# Altium schematic sheet TestMod_SEAx.SchDoc
size A3
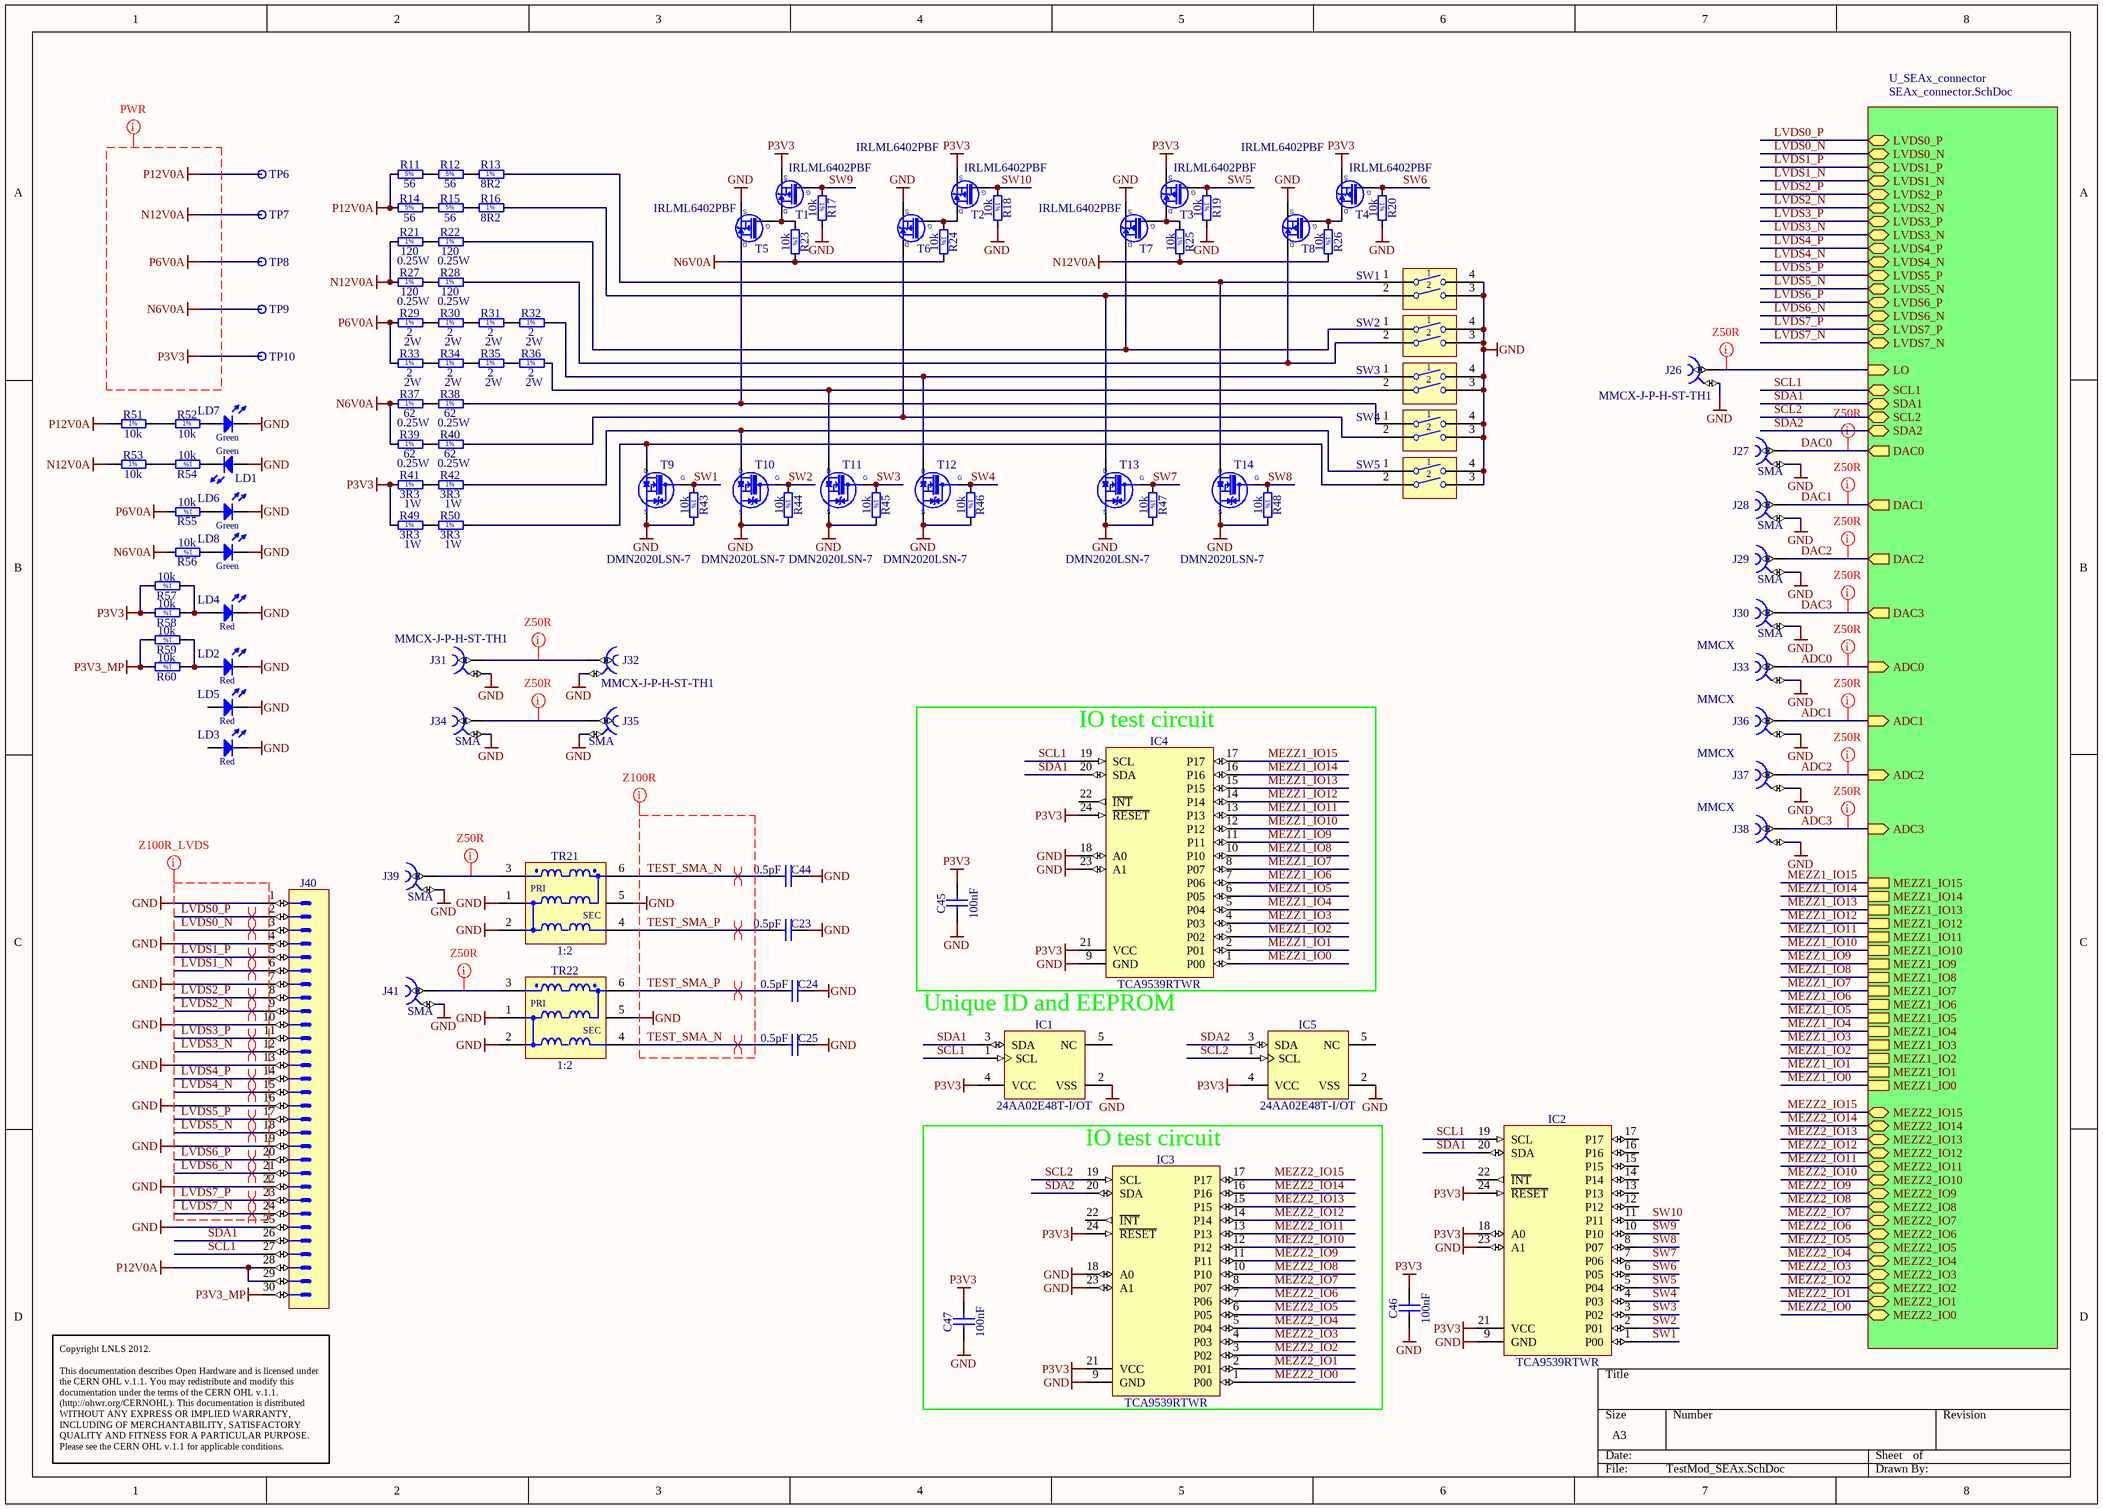
[diagram p0: TestMod_SEAx.SchDoc]

## Parts
C23  0.5pF  [CAPC1005X50N]
C24  0.5pF  [CAPC1005X50N]
C25  0.5pF  [CAPC1005X50N]
C44  0.5pF  [CAPC1005X50N]
C45  100nF  [CAPC1005X55N]
C46  100nF  [CAPC1005X55N]
C47  100nF  [CAPC1005X55N]
IC1  24AA02E48T-I/OT  [SOT95P280X145-5N]
IC2  TCA9539RTWR  [QFN50P400X400X80-25N-S255]
IC3  TCA9539RTWR  [QFN50P400X400X80-25N-S255]
IC4  TCA9539RTWR  [QFN50P400X400X80-25N-S255]
IC5  24AA02E48T-I/OT  [SOT95P280X145-5N]
J26  Manufacturer Part Number: MMCX-J-P-H-ST-TH1  [SAMTEC_MMCX-J-P-H-ST-TH1]  (hidden comment: Coax_1Female_1Shield)
J27  SMA  [AMPHENOL_901-143_IN BOARD]
J28  SMA  [AMPHENOL_901-143_IN BOARD]
J29  SMA  [AMPHENOL_901-143_IN BOARD]
J30  SMA  [AMPHENOL_901-143_IN BOARD]
J31  Manufacturer Part Number: MMCX-J-P-H-ST-TH1  [SAMTEC_MMCX-J-P-H-ST-TH1]  (hidden comment: Coax_1Female_1Shield)
J32  Manufacturer Part Number: MMCX-J-P-H-ST-TH1  [SAMTEC_MMCX-J-P-H-ST-TH1]  (hidden comment: Coax_1Female_1Shield)
J33  Family: MMCX  [HUBER-SUHNER_85_MMCX-50-0-1/111_OE]  (hidden comment: Coax_1Female_1Shield)
J34  SMA  [TYCO_5-1814832-1]
J35  SMA  [TYCO_5-1814832-1]
J36  Family: MMCX  [HUBER-SUHNER_85_MMCX-50-0-1/111_OE]  (hidden comment: Coax_1Female_1Shield)
J37  Family: MMCX  [HUBER-SUHNER_85_MMCX-50-0-1/111_OE]  (hidden comment: Coax_1Female_1Shield)
J38  Family: MMCX  [HUBER-SUHNER_85_MMCX-50-0-1/111_OE]  (hidden comment: Coax_1Female_1Shield)
J39  SMA  [TYCO_5-1814832-1]
J40  (no value)  [3M_N2530-6002RB]
J41  SMA  [TYCO_5-1814832-1]
LD1  Green  [LED_KINGBRIGHT_L-13GD]
LD2  Red  [LED_KINGBRIGHT_L-13ID]
LD3  Red  [LED_KINGBRIGHT_L-13ID]
LD4  Red  [LED_KINGBRIGHT_L-13ID]
LD5  Red  [LED_KINGBRIGHT_L-13ID]
LD6  Green  [LED_KINGBRIGHT_L-13GD]
LD7  Green  [LED_KINGBRIGHT_L-13GD]
LD8  Green  [LED_KINGBRIGHT_L-13GD]
R11  56  [RESC6331X70N]
R12  56  [RESC6331X70N]
R13  8R2  [RESC3216X65N]
R14  56  [RESC6331X70N]
R15  56  [RESC6331X70N]
R16  8R2  [RESC3216X65N]
R17  10k  [RESC1005X40N]
R18  10k  [RESC1005X40N]
R19  10k  [RESC1005X40N]
R20  10k  [RESC1005X40N]
R21  120  Power: 0.25W  [RESC3216X65N]
R22  120  Power: 0.25W  [RESC3216X65N]
R23  10k  [RESC1005X40N]
R24  10k  [RESC1005X40N]
R25  10k  [RESC1005X40N]
R26  10k  [RESC1005X40N]
R27  120  Power: 0.25W  [RESC3216X65N]
R28  120  Power: 0.25W  [RESC3216X65N]
R29  2  Power: 2W  [RESM11670X449N]
R30  2  Power: 2W  [RESM11670X449N]
R31  2  Power: 2W  [RESM11670X449N]
R32  2  Power: 2W  [RESM11670X449N]
R33  2  Power: 2W  [RESM11670X449N]
R34  2  Power: 2W  [RESM11670X449N]
R35  2  Power: 2W  [RESM11670X449N]
R36  2  Power: 2W  [RESM11670X449N]
R37  62  Power: 0.25W  [RESC3216X65N]
R38  62  Power: 0.25W  [RESC3216X65N]
R39  62  Power: 0.25W  [RESC3216X65N]
R40  62  Power: 0.25W  [RESC3216X65N]
R41  3R3  Power: 1W  [RESC6331X70N]
R42  3R3  Power: 1W  [RESC6331X70N]
R43  10k  [RESC1005X40N]
R44  10k  [RESC1005X40N]
R45  10k  [RESC1005X40N]
R46  10k  [RESC1005X40N]
R47  10k  [RESC1005X40N]
R48  10k  [RESC1005X40N]
R49  3R3  Power: 1W  [RESC6331X70N]
R50  3R3  Power: 1W  [RESC6331X70N]
R51  10k  [RESC1005X40N]
R52  10k  [RESC1005X40N]
R53  10k  [RESC1005X40N]
R54  10k  [RESC1005X40N]
R55  10k  [RESC1005X40N]
R56  10k  [RESC1005X40N]
R57  10k  [RESC1005X40N]
R58  10k  [RESC1005X40N]
R59  10k  [RESC1005X40N]
R60  10k  [RESC1005X40N]
SW1  Switch  [SW_OMRON_A6S-2102-H]  (value not drawn)
SW2  Switch  [SW_OMRON_A6S-2102-H]  (value not drawn)
SW3  Switch  [SW_OMRON_A6S-2102-H]  (value not drawn)
SW4  Switch  [SW_OMRON_A6S-2102-H]  (value not drawn)
SW5  Switch  [SW_OMRON_A6S-2102-H]  (value not drawn)
T1  IRLML6402PBF  [SOT95P237X112-3N]
T2  IRLML6402PBF  [SOT95P237X112-3N]
T3  IRLML6402PBF  [SOT95P237X112-3N]
T4  IRLML6402PBF  [SOT95P237X112-3N]
T5  IRLML6402PBF  [SOT95P237X112-3N]
T6  IRLML6402PBF  [SOT95P237X112-3N]
T7  IRLML6402PBF  [SOT95P237X112-3N]
T8  IRLML6402PBF  [SOT95P237X112-3N]
T9  DMN2020LSN-7  [SOT95P285X140-3N]
T10  DMN2020LSN-7  [SOT95P285X140-3N]
T11  DMN2020LSN-7  [SOT95P285X140-3N]
T12  DMN2020LSN-7  [SOT95P285X140-3N]
T13  DMN2020LSN-7  [SOT95P285X140-3N]
T14  DMN2020LSN-7  [SOT95P285X140-3N]
TP6  Test Point  [TPS127]  (value not drawn)
TP7  Test Point  [TPS127]  (value not drawn)
TP8  Test Point  [TPS127]  (value not drawn)
TP9  Test Point  [TPS127]  (value not drawn)
TP10  Test Point  [TPS127]  (value not drawn)
TR21  1:2  [XFMR_MINI-CIRCUITS_DB1627]
TR22  1:2  [XFMR_MINI-CIRCUITS_DB1627]

## Blocks framed on the sheet
IO test circuit: C45 IC4
IO test circuit: C47 IC3

## Sub-sheets
U_SEAx_connector = SEAx_connector.SchDoc: ADC0 (in), ADC3 (in), ADC2 (in), ADC1 (in), MEZZ2_IO15 (bidir), MEZZ2_IO14 (bidir), MEZZ2_IO13 (bidir), MEZZ2_IO12 (bidir), MEZZ2_IO11 (bidir), MEZZ2_IO10 (bidir), MEZZ2_IO9 (bidir), MEZZ2_IO8 (bidir), MEZZ2_IO7 (bidir), MEZZ2_IO6 (bidir), MEZZ2_IO5 (bidir), MEZZ2_IO4 (bidir), MEZZ2_IO3 (bidir), MEZZ2_IO2 (bidir), MEZZ2_IO1 (bidir), MEZZ2_IO0 (bidir), MEZZ1_IO15, MEZZ1_IO14, MEZZ1_IO13, MEZZ1_IO12, MEZZ1_IO11, MEZZ1_IO10, MEZZ1_IO9, MEZZ1_IO8, MEZZ1_IO7, MEZZ1_IO6, MEZZ1_IO5, MEZZ1_IO4, MEZZ1_IO3, MEZZ1_IO2, MEZZ1_IO1, MEZZ1_IO0, SCL1 (bidir), SDA1 (bidir), SCL2 (bidir), SDA2 (bidir), LVDS0_P (bidir), LVDS0_N (bidir), LVDS1_P (bidir), LVDS1_N (bidir), LVDS2_P (bidir), LVDS2_N (bidir), LVDS3_P (bidir), LVDS3_N (bidir), LVDS4_P (bidir), LVDS4_N (bidir), LVDS5_P (bidir), LVDS5_N (bidir), LVDS6_P (bidir), LVDS6_N (bidir), LVDS7_P (bidir), LVDS7_N (bidir), LO (in), DAC0 (out), DAC3 (out), DAC2 (out), DAC1 (out)

## Nets
GND: C23.2 C24.2 C25.2 C44.2 C45.1 C46.1 C47.1 IC1.2(VSS) IC2.9(GND) IC2.23(A1) IC3.9(GND) IC3.18(A0) IC3.23(A1) IC4.9(GND) IC4.18(A0) IC4.23(A1) IC5.2(VSS) J26.2 J27.2 J28.2 J29.2 J30.2 J31.2 J32.2 J33.2 J34.2 J35.2 J36.2 J37.2 J38.2 J39.2 J40.1 J40.4 J40.7 J40.10 J40.13 J40.16 J40.19 J40.22 J40.25 J41.2 LD1.2(A) LD2.1(C) LD3.1(C) LD4.1(C) LD5.1(C) LD6.1(C) LD7.1(C) LD8.1(C) R17.2 R18.2 R19.2 R20.2 R43.2 R44.2 R45.2 R46.2 R47.2 R48.2 SW1.3 SW1.4 SW2.3 SW2.4 SW3.3 SW3.4 SW4.3 SW4.4 SW5.3 SW5.4 T5.2(S) T6.2(S) T7.2(S) T8.2(S) T9.2(S) T10.2(S) T11.2(S) T12.2(S) T13.2(S) T14.2(S) TR21.1(P1) TR21.2(P1) TR21.5(NC) TR22.1(P1) TR22.2(P1) TR22.5(NC)
N6V0A: R23.2 R24.2 R37.1 R39.1 R56.2 TP9.1
N12V0A: R21.1 R25.2 R26.2 R27.1 R53.1 TP7.1
P3V3: C45.2 C46.2 C47.2 IC1.4(VCC) IC2.18(A0) IC2.21(VCC) IC2.24(~{RESET}) IC3.21(VCC) IC3.24(~{RESET}) IC4.21(VCC) IC4.24(~{RESET}) IC5.4(VCC) R41.1 R49.1 R57.2 R58.2 T1.2(S) T2.2(S) T3.2(S) T4.2(S) TP10.1
P3V3_MP: J40.30 R59.2 R60.2
P6V0A: R29.1 R33.1 R55.2 TP8.1
P12V0A: J40.28 J40.29 R11.1 R14.1 R51.1 TP6.1
ADC0: J33.1 ; sheet U_SEAx_connector/ADC0
ADC1: J36.1 ; sheet U_SEAx_connector/ADC1
ADC2: J37.1 ; sheet U_SEAx_connector/ADC2
ADC3: J38.1 ; sheet U_SEAx_connector/ADC3
DAC0: J27.1 ; sheet U_SEAx_connector/DAC0
DAC1: J28.1 ; sheet U_SEAx_connector/DAC1
DAC2: J29.1 ; sheet U_SEAx_connector/DAC2
DAC3: J30.1 ; sheet U_SEAx_connector/DAC3
LVDS0_N: J40.3 ; sheet U_SEAx_connector/LVDS0_N
LVDS0_P: J40.2 ; sheet U_SEAx_connector/LVDS0_P
LVDS1_N: J40.6 ; sheet U_SEAx_connector/LVDS1_N
LVDS1_P: J40.5 ; sheet U_SEAx_connector/LVDS1_P
LVDS2_N: J40.9 ; sheet U_SEAx_connector/LVDS2_N
LVDS2_P: J40.8 ; sheet U_SEAx_connector/LVDS2_P
LVDS3_N: J40.12 ; sheet U_SEAx_connector/LVDS3_N
LVDS3_P: J40.11 ; sheet U_SEAx_connector/LVDS3_P
LVDS4_N: J40.15 ; sheet U_SEAx_connector/LVDS4_N
LVDS4_P: J40.14 ; sheet U_SEAx_connector/LVDS4_P
LVDS5_N: J40.18 ; sheet U_SEAx_connector/LVDS5_N
LVDS5_P: J40.17 ; sheet U_SEAx_connector/LVDS5_P
LVDS6_N: J40.21 ; sheet U_SEAx_connector/LVDS6_N
LVDS6_P: J40.20 ; sheet U_SEAx_connector/LVDS6_P
LVDS7_N: J40.24 ; sheet U_SEAx_connector/LVDS7_N
LVDS7_P: J40.23 ; sheet U_SEAx_connector/LVDS7_P
MEZZ1_IO0: IC4.1(P00) ; sheet U_SEAx_connector/MEZZ1_IO0
MEZZ1_IO1: IC4.2(P01) ; sheet U_SEAx_connector/MEZZ1_IO1
MEZZ1_IO2: IC4.3(P02) ; sheet U_SEAx_connector/MEZZ1_IO2
MEZZ1_IO3: IC4.4(P03) ; sheet U_SEAx_connector/MEZZ1_IO3
MEZZ1_IO4: IC4.5(P04) ; sheet U_SEAx_connector/MEZZ1_IO4
MEZZ1_IO5: IC4.6(P05) ; sheet U_SEAx_connector/MEZZ1_IO5
MEZZ1_IO6: IC4.7(P06) ; sheet U_SEAx_connector/MEZZ1_IO6
MEZZ1_IO7: IC4.8(P07) ; sheet U_SEAx_connector/MEZZ1_IO7
MEZZ1_IO8: IC4.10(P10) ; sheet U_SEAx_connector/MEZZ1_IO8
MEZZ1_IO9: IC4.11(P11) ; sheet U_SEAx_connector/MEZZ1_IO9
MEZZ1_IO10: IC4.12(P12) ; sheet U_SEAx_connector/MEZZ1_IO10
MEZZ1_IO11: IC4.13(P13) ; sheet U_SEAx_connector/MEZZ1_IO11
MEZZ1_IO12: IC4.14(P14) ; sheet U_SEAx_connector/MEZZ1_IO12
MEZZ1_IO13: IC4.15(P15) ; sheet U_SEAx_connector/MEZZ1_IO13
MEZZ1_IO14: IC4.16(P16) ; sheet U_SEAx_connector/MEZZ1_IO14
MEZZ1_IO15: IC4.17(P17) ; sheet U_SEAx_connector/MEZZ1_IO15
MEZZ2_IO0: IC3.1(P00) ; sheet U_SEAx_connector/MEZZ2_IO0
MEZZ2_IO1: IC3.2(P01) ; sheet U_SEAx_connector/MEZZ2_IO1
MEZZ2_IO2: IC3.3(P02) ; sheet U_SEAx_connector/MEZZ2_IO2
MEZZ2_IO3: IC3.4(P03) ; sheet U_SEAx_connector/MEZZ2_IO3
MEZZ2_IO4: IC3.5(P04) ; sheet U_SEAx_connector/MEZZ2_IO4
MEZZ2_IO5: IC3.6(P05) ; sheet U_SEAx_connector/MEZZ2_IO5
MEZZ2_IO6: IC3.7(P06) ; sheet U_SEAx_connector/MEZZ2_IO6
MEZZ2_IO7: IC3.8(P07) ; sheet U_SEAx_connector/MEZZ2_IO7
MEZZ2_IO8: IC3.10(P10) ; sheet U_SEAx_connector/MEZZ2_IO8
MEZZ2_IO9: IC3.11(P11) ; sheet U_SEAx_connector/MEZZ2_IO9
MEZZ2_IO10: IC3.12(P12) ; sheet U_SEAx_connector/MEZZ2_IO10
MEZZ2_IO11: IC3.13(P13) ; sheet U_SEAx_connector/MEZZ2_IO11
MEZZ2_IO12: IC3.14(P14) ; sheet U_SEAx_connector/MEZZ2_IO12
MEZZ2_IO13: IC3.15(P15) ; sheet U_SEAx_connector/MEZZ2_IO13
MEZZ2_IO14: IC3.16(P16) ; sheet U_SEAx_connector/MEZZ2_IO14
MEZZ2_IO15: IC3.17(P17) ; sheet U_SEAx_connector/MEZZ2_IO15
SCL1: IC1.1(SCL) IC2.19(SCL) IC4.19(SCL) J40.27 ; sheet U_SEAx_connector/SCL1
SCL2: IC3.19(SCL) IC5.1(SCL) ; sheet U_SEAx_connector/SCL2
SDA1: IC1.3(SDA) IC2.20(SDA) IC4.20(SDA) J40.26 ; sheet U_SEAx_connector/SDA1
SDA2: IC3.20(SDA) IC5.3(SDA) ; sheet U_SEAx_connector/SDA2
SW1: IC2.1(P00) R43.1 T9.1(G)
SW2: IC2.2(P01) R44.1 T10.1(G)
SW3: IC2.3(P02) R45.1 T11.1(G)
SW4: IC2.4(P03) R46.1 T12.1(G)
SW5: IC2.5(P04) R19.1 T3.1(G)
SW6: IC2.6(P05) R20.1 T4.1(G)
SW7: IC2.7(P06) R47.1 T13.1(G)
SW8: IC2.8(P07) R48.1 T14.1(G)
SW9: IC2.10(P10) R17.1 T1.1(G)
SW10: IC2.11(P11) R18.1 T2.1(G)
TEST_SMA_N: C25.1 C44.1 TR21.6(S1) TR22.4(S1)
TEST_SMA_P: C23.1 C24.1 TR21.4(S1) TR22.6(S1)
NetJ26_1: J26.1 ; sheet U_SEAx_connector/LO
NetJ31_1: J31.1 J32.1
NetJ34_1: J34.1 J35.1
NetJ39_1: J39.1 TR21.3(P1)
NetJ41_1: J41.1 TR22.3(P1)
NetLD1_1: LD1.1(C) R54.1
NetLD2_2: LD2.2(A) R59.1 R60.1
NetLD4_2: LD4.2(A) R57.1 R58.1
NetLD6_2: LD6.2(A) R55.1
NetLD7_2: LD7.2(A) R52.2
NetLD8_2: LD8.2(A) R56.1
NetR11_2: R11.2 R12.1
NetR12_2: R12.2 R13.1
NetR13_2: R13.2 SW1.1 T14.3(D)
NetR14_2: R14.2 R15.1
NetR15_2: R15.2 R16.1
NetR16_2: R16.2 SW1.2 T13.3(D)
NetR21_2: R21.2 R22.1
NetR22_2: R22.2 SW2.1 T7.3(D)
NetR23_1: R23.1 T1.3(D) T5.1(G)
NetR24_1: R24.1 T2.3(D) T6.1(G)
NetR25_1: R25.1 T3.3(D) T7.1(G)
NetR26_1: R26.1 T4.3(D) T8.1(G)
NetR27_2: R27.2 R28.1
NetR28_2: R28.2 SW2.2 T8.3(D)
NetR29_2: R29.2 R30.1
NetR30_2: R30.2 R31.1
NetR31_2: R31.2 R32.1
NetR32_2: R32.2 SW3.1 T12.3(D)
NetR33_2: R33.2 R34.1
NetR34_2: R34.2 R35.1
NetR35_2: R35.2 R36.1
NetR36_2: R36.2 SW3.2 T11.3(D)
NetR37_2: R37.2 R38.1
NetR38_2: R38.2 SW4.1 T5.3(D)
NetR39_2: R39.2 R40.1
NetR40_2: R40.2 SW4.2 T6.3(D)
NetR41_2: R41.2 R42.1
NetR42_2: R42.2 SW5.1 T10.3(D)
NetR49_2: R49.2 R50.1
NetR50_2: R50.2 SW5.2 T9.3(D)
NetR51_2: R51.2 R52.1
NetR53_2: R53.2 R54.2

Not connected (* = marked no-connect by the designer): IC1 5(NC); IC2 12(P12) 13(P13) 14(P14) 15(P15) 16(P16) 17(P17) 22(~{INT}); IC3 22(~{INT}); IC4 22(~{INT}); IC5 5(NC); LD3 2(A); LD5 2(A)

## Layout directives
differential pair: LVDS0_N, LVDS0_P, LVDS1_N, LVDS1_P, LVDS2_N, LVDS2_P, LVDS3_N, LVDS3_P, LVDS4_N, LVDS4_P, LVDS5_N, LVDS5_P, LVDS6_N, LVDS6_P, LVDS7_N, LVDS7_P, TEST_SMA_N, TEST_SMA_P
rule Impedance Constraint [Min = 49.00    Max = 51.00    ]; net class Z50R: ADC0, ADC1, ADC2, ADC3, DAC0, DAC1, DAC2, DAC3, NetJ26_1, NetJ31_1, NetJ34_1, NetJ39_1, NetJ41_1
rule Differential Pairs Routing [Pref Gap = 6mil    Min Gap  = 6mil    Max Gap  = 6milPref Width = 11mil    Min Width  = 11mil    Max Width  = 11mil]: GND, LVDS0_N, LVDS0_P, LVDS1_N, LVDS1_P, LVDS2_N, LVDS2_P, LVDS3_N, LVDS3_P, LVDS4_N, LVDS4_P, LVDS5_N, LVDS5_P, LVDS6_N, LVDS6_P, LVDS7_N, LVDS7_P
rule Width Constraint [Pref Width = 30mil    Min Width = 10mil    Max Width = 100mil]; net class HPWR: N6V0A, N12V0A, P3V3, P6V0A, P12V0A
rule Differential Pairs Routing [Pref Gap = 12mil    Min Gap  = 12mil    Max Gap  = 12milPref Width = 14mil    Min Width  = 14mil    Max Width  = 14mil]: GND, TEST_SMA_N, TEST_SMA_P

## Notes on the sheet
- Unique ID and EEPROM
- (near J40) Copyright LNLS 2012.
  This documentation describes Open Hardware and is licensed under the CERN OHL v.1.1. You may redistribute and modify this documentation under the terms of the CERN OHL v.1.1. (http://ohwr.org/CERNOHL). This documentation is distributed WITHOUT ANY EXPRESS OR IMPLIED WARRANTY, INCLUDING OF MERCHANTABILITY, SATISFACTORY QUALITY AND FITNESS FOR A PARTICULAR PURPOSE. Please see the CERN OHL v.1.1 for applicable conditions.
- (in symbol R0402_10K_1%_0.0625W_100PPM) 1%
- (in symbol R1206_8R2_1%_0.25W_200PPM) 1%
- (in symbol R1206_62R_1%_0.25W_100PPM) 1%
- (in symbol R1206_120R_1%_0.25W_100PPM) 1%
- (in symbol R2512_3R3_1%_1W_200PPM) 1%
- (in symbol R2512_56R_5%_1W_200PPM) 5%
- (in symbol R4527_2R_1%_2W_50PPM) 1%
- (in symbol XFMR_MINI-CIRCUITS_TCM2-43X+) PRI; SEC

## Library data of the parts
C23-C25 C44 = CC0402_0.5PF_25V_0.05PF_AVX_04023J0R5ABSTR: Non-polarised capacitor; Part Description: Thin-Film Chip Capacitors for RF Signal and Power Applications, Accu-P Series; Manufacturer: AVX; Voltage: 25V; Tolerance: ±0.05pF; Part Number: CC0402_0.5PF_25V_0.05PF_AVX_04023J0R5ABSTR; Component Kind: Standard; Component Type: Standard; Pin Count: 2; Value: 0.5pF; Status: None; Manufacturer Part Number: 04023J0R5ABSTR; Case: 0402; Mounted: Yes; Socket: No; SMD: Yes; Sense: No; ComponentHeight: 0.5mm; HelpURL: \\cern.ch\dfs\Applications\Altium\Datasheets\CC0402_AVX_ACCU-P.pdf; Author: CERN DEM JLC; CreateDate: 22.02.2017; LatestRevisionDate: 22.02.2017
C45-C47 = CC0402_100NF_16V_10%_X5R: Non-polarised capacitor; Part Description: SMD Multilayer Chip Ceramic Capacitor; Manufacturer: GENERIC; Manufacturer1 Part Number: GRM155R61C104KA88D; Voltage: 16V; TC: X5R; Tolerance: ±10%; Part Number: CC0402_100NF_16V_10%_X5R; Component Kind: Standard; Component Type: Standard; Pin Count: 2; Value: 100nF; Status: None; Manufacturer Part Number: CC0402_100NF_16V_10%_X5R; Case: 0402; Mounted: Yes; Socket: No; SMD: Yes; Sense: No; Manufacturer1 Example: MURATA; Manufacturer1 ComponentHeight: 0.55mm; HelpURL: \\cern.ch\dfs\Applications\Altium\Datasheets\CC0402_X5R_MURATA_GRM.pdf; Author: CERN DEM JLC; CreateDate: 10.12.2013; LatestRevisionDate: 10.12.2013
IC1 IC5 = 24AA02E48T-I/OT: 1.7V-5.5V, 2K I2C Serial EEPROM With EUI-48 Node Identity; Manufacturer: MICROCHIP TECHNOLOGY; PressFit: No; Bonding: No; Part Number: 24AA02E48T-I/OT; Component Kind: Standard; Component Type: Standard; Device: 24AA02E48T-I/OT; PackageDescription: SOT, 0.95mm pitch; 5 pin, 1.60mm W X 2.90mm L X 1.45mm H body, IPC Medium Density; Part Description: 1.7V-5.5V, 2K I2C Serial EEPROM With EUI-48 Node Identity; Manufacturer Part Number: 24AA02E48T-I/OT; Pin Count: 5; Case: SOT23-5; Mounted: Yes; Socket: No; SMD: Yes; Sense: No; ComponentHeight: 1.45mm; HelpURL: \\cern.ch\dfs\Applications\Altium\Datasheets\24AA02E48T-I-OT.pdf; Author: CERN DEM MR; CreateDate: 31.03.2016; LatestRevisionDate: 31.03.2016
IC2-IC4 = TCA9539RTWR: Low-Voltage 16-Bit I2C and SMBus I/O Expander; Part Description: Low Voltage 16-Bit I2C and SMBus Low-Power I/O Expander With Interrupt Output, Reset Pin, Configuration Registers; Manufacturer: TEXAS INSTRUMENTS; PressFit: No; Bonding: No; Part Number: TCA9539RTWR; Component Kind: Standard; Component Type: Standard; Device: TCA9539RTWR; PackageDescription: QFN, 0.50mm Pitch, Square; 24 Pin, 4.00mm X 4.00mm X 0.80mm H Body (w/Thermal Tab 2.55 X 2.55 mm), IPC Medium Density; Manufacturer Part Number: TCA9539RTWR; Pin Count: 25; Case: QFN24; Mounted: Yes; Socket: No; SMD: Yes; Sense: No; ComponentHeight: 0.8mm; Author: CERN DEM MR; HelpURL: \\cern.ch\dfs\Applications\Altium\Datasheets\TCA9539RTWR.pdf; CreateDate: 01.12.2015; LatestRevisionDate: 01.12.2015
J26 J31 J32 = SAMTEC_MMCX-J-P-H-ST-TH1: Part Description: Straight Through-hole 50 Ohm Micro Mini RF Jack, MMCX Series; Manufacturer: SAMTEC; PressFit: No; Part Number: SAMTEC_MMCX-J-P-H-ST-TH1; Component Kind: Standard; Component Type: Standard; Pin Count: 2; Mounted: Yes; Socket: No; Sense: No; SMD: No; Status: None; ComponentHeight: 4.35mm; HelpURL: \\cern.ch\dfs\Applications\Altium\Datasheets\SAMTEC_MMCX-J-P-H-ST-TH1.pdf; Author: CERN DEM JLC; CreateDate: 05.12.2012; LatestRevisionDate: 05.12.2012
J27-J30 = CON_SMA_RA_AMP: AMPHENOL_901-143; Part Description: 50 Ohm Through Hole SMA 90 degrees PCB Jack; PressFit: No; Part Number: AMPHENOL_901-143; Component Kind: Standard; Component Type: Standard; Pin Count: 5; Family: SMA; Mounted: Yes; Socket: No; SMD: No; Sense: No; Status: None; Manufacturer: AMPHENOL; Manufacturer Part Number: 901-143; ComponentHeight: 10.0mm; Author: LNLS DIG GBMB; CreateDate: 31/05/2016; LatestRevisionDate: 02/03/2017
J33 J36-J38 = HUBER-SUHNER_85_MMCX-50-0-1/111_OE: Part Description: MMCX 50 Ohms Right Angle PCB Jack; Manufacturer: HUBER+SUHNER; PressFit: No; Part Number: HUBER-SUHNER_85_MMCX-50-0-1/111_OE; Component Kind: Standard; Component Type: Standard; Pin Count: 2; Mounted: Yes; Socket: No; SMD: No; Sense: No; Status: None; Manufacturer Part Number: 85_MMCX-50-0-1/111_OE; ComponentHeight: 9.6mm; HelpURL: \\cern.ch\dfs\Applications\Altium\Datasheets\HUBER-SUHNER_85_MMCX-50-0-1-111_OE.pdf; Author: CERN DEM JLC; CreateDate: 06.11.2014; LatestRevisionDate: 06.11.2014
J34 J35 J39 J41 = TYCO_5-1814832-1: Part Description: 50 Ohms SMA Straight PCB Die Socket; Manufacturer: TYCO ELECTRONICS; PressFit: No; Part Number: TYCO_5-1814832-1; Component Kind: Standard; Component Type: Standard; Pin Count: 2; Family: SMA; Mounted: Yes; Socket: No; SMD: No; Sense: No; Status: None; Manufacturer Part Number: 5-1814832-1; ComponentHeight: 13.5mm; HelpURL: \\cern.ch\dfs\Applications\Altium\Datasheets\TYCO_5-1814832-1.pdf; Author: CERN DEM JLC; CreateDate: 17.11.2009; LatestRevisionDate: 17.11.2009
J40 = 3M_N2530-6002RB: Connector 30 Male; Part Description: 30 Contacts - Straight .100'' x .100'' Low Profile Four-Wall Header, 2500 Series; Manufacturer: 3M; PressFit: No; Part Number: 3M_N2530-6002RB; Component Kind: Standard; Component Type: Standard; Pin Count: 30; Family: Header 30; Mounted: Yes; Socket: No; SMD: No; Sense: No; Status: None; Manufacturer Part Number: N2530-6002RB; ComponentHeight: 10.03mm; HelpURL: \\cern.ch\dfs\Applications\Altium\Datasheets\3M_N2530-6002RB.pdf; Author: CERN DEM JLC; CreateDate: 11.02.2009; LatestRevisionDate: 11.08.2009
LD1 LD6-LD8 = LED_2mm_RA_Green: LED Green 2mm; Part Description: Green LED, 2mm round , RA; Manufacturer: KINGBRIGHT; Manufacturer Part Number: L-13GD; PressFit: No; Bonding: No; Part Number: LED_KINGBRIGHT_L-13GD; Component Kind: Standard; Component Type: Standard; Color: Green; PackageDescription: 2mm THT LED; Pin Count: 2; Mounted: Yes; Socket: No; SMD: No; Sense: No; ComponentHeight: 0.65mm; HelpURL: \\cern.ch\dfs\Applications\Altium\Datasheets\LED_KINGBRIGHT_KPH-1608SURCK.pdf; Author: GK; CreateDate: 03.07.2017; LatestRevisionDate: 03.07.2017
LD2-LD5 = LED_2mm_RA_Red: LED Red 2mm; Part Description: Red LED, 2mm round , RA; Manufacturer: KINGBRIGHT; Manufacturer Part Number: L-13ID; PressFit: No; Bonding: No; Part Number: LED_KINGBRIGHT_L-13ID; Component Kind: Standard; Component Type: Standard; Color: Red; PackageDescription: 2mm THT LED; Pin Count: 2; Mounted: Yes; Socket: No; SMD: No; Sense: No; ComponentHeight: 0.65mm; HelpURL: \\cern.ch\dfs\Applications\Altium\Datasheets\LED_KINGBRIGHT_KPH-1608SURCK.pdf; Author: GK; CreateDate: 03.07.2017; LatestRevisionDate: 03.07.2017
R11 R12 R14 R15 = R2512_56R_5%_1W_200PPM: Resistor - 5%; Part Description: Surface Mount Power Resistor; Manufacturer: GENERIC; Manufacturer1 Part Number: 352056RJT; Power: 1W; TC: ±200ppm/°C; Part Number: R2512_56R_5%_1W_200PPM; Component Kind: Standard; Component Type: Standard; Pin Count: 2; Value: 56; Status: None; Tolerance: ±5%; Manufacturer Part Number: R2512_56R_5%_1W_200PPM; Case: 2512; Mounted: Yes; Sense: No; Socket: No; SMD: Yes; Manufacturer1 Example: TYCO ELECTRONICS; Manufacturer1 ComponentHeight: 0.7mm; HelpURL: \\cern.ch\dfs\Applications\Altium\Datasheets\R2512_TYCO_3520.pdf; Author: CERN DEM JLC; CreateDate: 21.07.2010; LatestRevisionDate: 21.07.2010
R13 R16 = R1206_8R2_1%_0.25W_200PPM: Resistor - 1%; Part Description: General Purpose Thick Film Chip Resistor; Manufacturer: GENERIC; Manufacturer1 Part Number: 232272468208; Power: 0.25W; TC: ±200ppm/°C; Part Number: R1206_8R2_1%_0.25W_200PPM; Component Kind: Standard; Component Type: Standard; Pin Count: 2; Value: 8R2; Status: Preferred; Tolerance: ±1%; Manufacturer Part Number: R1206_8R2_1%_0.25W_200PPM; Case: 1206; Mounted: Yes; Sense: No; Socket: No; SMD: Yes; Manufacturer1 Example: PHYCOMP; Manufacturer1 ComponentHeight: 0.65mm; HelpURL: \\cern.ch\dfs\Applications\Altium\Datasheets\R1206_Phycomp_RC1206.pdf; Author: CERN DEM JLC; CreateDate: 03.12.2007; LatestRevisionDate: 24.06.2009
R17-R20 R23-R26 R43-R48 R51-R60 = R0402_10K_1%_0.0625W_100PPM: Resistor - 1%; Part Description: General Purpose Thick Film Chip Resistor; Manufacturer: GENERIC; Manufacturer1 Part Number: 232270671003L; TC: ±100ppm/°C; Part Number: R0402_10K_1%_0.0625W_100PPM; Component Kind: Standard; Component Type: Standard; Pin Count: 2; Value: 10k; Status: Not recommended; Power: 0.0625W; Tolerance: ±1%; Manufacturer Part Number: R0402_10K_1%_0.0625W_100PPM; Case: 0402; Mounted: Yes; Sense: No; Socket: No; SMD: Yes; Manufacturer1 Example: YAGEO PHYCOMP; Manufacturer1 ComponentHeight: 0.4mm; HelpURL: \\cern.ch\dfs\Applications\Altium\Datasheets\R0402_Phycomp_RC0402.pdf; Author: CERN DEM JLC; CreateDate: 03.12.2007; LatestRevisionDate: 17.10.2012
R21 R22 R27 R28 = R1206_120R_1%_0.25W_100PPM: Resistor - 1%; Part Description: General Purpose Thick Film Chip Resistor; Manufacturer: GENERIC; Manufacturer1 Part Number: NRC12F1200TRF; TC: ±100ppm/°C; Part Number: R1206_120R_1%_0.25W_100PPM; Component Kind: Standard; Component Type: Standard; Pin Count: 2; Value: 120; Status: Preferred; Tolerance: ±1%; Manufacturer Part Number: R1206_120R_1%_0.25W_100PPM; Case: 1206; Mounted: Yes; Sense: No; Socket: No; SMD: Yes; Manufacturer1 Example: NIC COMPONENT; Manufacturer1 ComponentHeight: 0.65mm; HelpURL: \\cern.ch\dfs\Applications\Altium\Datasheets\R1206_NIC_NRC.pdf; Author: CERN DEM JLC; CreateDate: 03.12.2007; LatestRevisionDate: 13.03.2008
R29-R36 = R4527_2R_1%_2W_50PPM: Resistor - 1%; Part Description: Surface Mount Precision Power Wirewound Resistor; Manufacturer: VISHAY DALE; Manufacturer Part Number: WSC45272R000FEA; TC: ±50ppm/°C; Part Number: R4527_2R_1%_2W_50PPM; Component Kind: Standard; Component Type: Standard; Pin Count: 2; Value: 2; Status: None; Tolerance: ±1%; Case: 4527; Mounted: Yes; Sense: No; Socket: No; SMD: Yes; ComponentHeight: 4.49mm; HelpURL: \\cern.ch\dfs\Applications\Altium\Datasheets\R4527_VISHAY_WSC.pdf; Author: CERN DEM JLC; CreateDate: 22.03.2011; LatestRevisionDate: 22.03.2011
R37-R40 = R1206_62R_1%_0.25W_100PPM: Resistor - 1%; Part Description: General Purpose Thick Film Chip Resistor; Manufacturer: GENERIC; Manufacturer1 Part Number: NRC12F62R0TRF; TC: ±100ppm/°C; Part Number: R1206_62R_1%_0.25W_100PPM; Component Kind: Standard; Component Type: Standard; Pin Count: 2; Value: 62; Status: Preferred; Tolerance: ±1%; Manufacturer Part Number: R1206_62R_1%_0.25W_100PPM; Case: 1206; Mounted: Yes; Sense: No; Socket: No; SMD: Yes; Manufacturer1 Example: NIC COMPONENT; Manufacturer1 ComponentHeight: 0.65mm; HelpURL: \\cern.ch\dfs\Applications\Altium\Datasheets\R1206_NIC_NRC.pdf; Author: CERN DEM JLC; CreateDate: 03.12.2007; LatestRevisionDate: 13.03.2008
R41 R42 R49 R50 = R2512_3R3_1%_1W_200PPM: Resistor - 1%; Part Description: Thick Film Chip Resistor; Manufacturer: GENERIC; Manufacturer1 Part Number: 232276363308L or RC2512FK-073R3L; TC: ±200ppm/°C; Part Number: R2512_3R3_1%_1W_200PPM; Component Kind: Standard; Component Type: Standard; Pin Count: 2; Value: 3R3; Status: Preferred; Tolerance: ±1%; Manufacturer Part Number: R2512_3R3_1%_1W_200PPM; Case: 2512; Mounted: Yes; Sense: No; Socket: No; SMD: Yes; Manufacturer1 Example: YAGEO PHYCOMP; Manufacturer1 ComponentHeight: 0.65mm; HelpURL: \\cern.ch\dfs\Applications\Altium\Datasheets\R2512_Phycomp_RC2512.pdf; Author: CERN DEM JLC; CreateDate: 21.07.2008; LatestRevisionDate: 17.10.2012
SW1-SW5 = SW_OMRON_A6S-2102-H: 2 Ways SPST DIP Switch; Part Description: 2 Ways SPST DIP Switch, White Flat Actuator with Seal Tape, Contact Rating 25mA 24VDC; Manufacturer: OMRON; PressFit: No; Part Number: SW_OMRON_A6S-2102-H; Component Kind: Standard; Component Type: Standard; Pin Count: 4; PackageDescription: Pitch 2.54mm, Body 6.2x6.4mm, 2 Ways SPST Surface-Mounting DIP Switch, OMRON A6S-H; Family: Switch; Mounted: Yes; Socket: No; SMD: Yes; Sense: No; Status: None; Manufacturer Part Number: A6S-2102-H; ComponentHeight: 3.8mm; HelpURL: \\cern.ch\dfs\Applications\Altium\Datasheets\SW_OMRON_A6S-2102-H.pdf; Author: CERN DEM JMW; CreateDate: 25.09.2008; LatestRevisionDate: 25.09.2008
T1-T8 = IRLML6402PBF: P-CHANNEL MOSFET WITH ZENER DIODE; Part Description: -20V -3.7A P-Channel HEXFET® Power MOSFET; Manufacturer: INTERNATIONAL RECTIFIER; PressFit: No; Bonding: No; Part Number: IRLML6402PBF; Component Kind: Standard; Component Type: Standard; Device: IRLML6402PBF; PackageDescription: SOT, 0.95mm, pitch; 3 pin,1.30mm W X 2.92mm L X 1.12mm H body, IPC Medium Density; Manufacturer Part Number: IRLML6402PBF; Pin Count: 3; Case: SOT23-3; Mounted: Yes; Socket: No; SMD: Yes; Sense: No; ComponentHeight: 1.12mm; HelpURL: \\cern.ch\dfs\Applications\Altium\Datasheets\IRLML6402PBF.pdf; Author: CERN DEM JLC; CreateDate: 29.08.2011; LatestRevisionDate: 29.08.2011
T9-T14 = DMN2020LSN-7: 20V, 6.9A, N-Channel Enhancement Mode MOSFET; Manufacturer: DIODES INCORPORATED; PressFit: No; Bonding: No; Part Number: DMN2020LSN-7; Component Kind: Standard; Component Type: Standard; Device: DMN2020LSN-7; PackageDescription: SOT23, 0.95mm Pitch; 3 Pin, 1.6mm W X 3mm L X 1.4mm H Body, IPC Medium Density; Part Description: 20V, 6.9A, N-Channel Enhancement Mode MOSFET; Manufacturer Part Number: DMN2020LSN-7; Pin Count: 3; Case: SOT23-3; Mounted: Yes; Socket: No; SMD: Yes; Sense: No; ComponentHeight: 1.15mm; HelpURL: \\cern.ch\dfs\Applications\Altium\Datasheets\DMN2020LSN-7.pdf; Author: CERN DEM JLC; CreateDate: 17.11.2014; LatestRevisionDate: 19.11.2014
TP6-TP10 = SMD_PAD_1.27X1.27MM: Part Description: 1.27mm x 1.27mm PCB Copper Area (SMD Test Point); Mounted: No; Part Number: SMD_PAD_1.27X1.27MM; Component Kind: Standard (No BOM); Component Type: Standard (No BOM); Pin Count: 1; Family: Test Point; Socket: No; SMD: Yes; Sense: No; Status: None; ComponentHeight: 0mm; HelpURL: Undefined; Author: CERN DEM JLC; CreateDate: 12.01.2008; LatestRevisionDate: 12.01.2008; PackageDescription: 1.27mm x 1.27mm PCB Copper Area (SMD Test Point)
TR21 TR22 = XFMR_MINI-CIRCUITS_TCM2-43X+: 50 OHMS 10 to 4000 MHz RF Transformer; Power: 0.4W; Part Number: XFMR_MINI-CIRCUITS_TCM2-43X+; Component Kind: Standard; Component Type: Standard; Pin Count: 6; Value: 1:2; Status: None; Part Description: 50 Ohms 10 to 4000MHz RF Transformer; Manufacturer: MINI-CIRCUITS; Manufacturer Part Number: TCM2-43X+; Mounted: Yes; Socket: No; Sense: No; SMD: Yes; ComponentHeight: 4.06mm; HelpURL: \\cern.ch\dfs\Applications\Altium\Datasheets\XFMR_MINI-CIRCUITS_TCM2-43X+.pdf; Author: CERN DEM BC; CreateDate: 12.02.2016; LatestRevisionDate: 12.02.2016